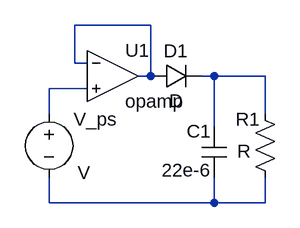
[diagram p0: schematic fig1.asc]
fig1.asc, the LTspice schematic file:
Version 4
SHEET 1 880 680
WIRE 224 64 128 64
WIRE 128 112 128 64
WIRE 144 112 128 112
WIRE 224 128 224 64
WIRE 224 128 208 128
WIRE 304 128 288 128
WIRE 368 128 304 128
WIRE 144 144 96 144
WIRE 96 176 96 144
WIRE 368 176 368 128
WIRE 304 192 304 128
WIRE 96 288 96 256
WIRE 304 288 304 256
WIRE 304 288 96 288
WIRE 368 288 368 256
WIRE 368 288 304 288
SYMBOL Opamps\\opamp 176 64 R0
SYMATTR InstName U1
SYMBOL voltage 96 160 R0
WINDOW 0 31 23 Left 2
WINDOW 3 36 90 Left 2
SYMATTR InstName V_ps
SYMBOL diode 224 144 R270
WINDOW 0 32 32 VTop 2
WINDOW 3 0 32 VBottom 2
SYMATTR InstName D1
SYMBOL cap 288 192 R0
WINDOW 0 -19 6 Left 2
WINDOW 3 -50 55 Left 2
SYMATTR InstName C1
SYMATTR Value 22e-6
SYMBOL res 352 160 R0
WINDOW 0 -21 23 Left 2
WINDOW 3 -19 63 Left 2
SYMATTR InstName R1

The netlist it stands for:
* fig1.asc
XU1 N001 N003 N001 opamp Aol=100K GBW=10Meg  ; pins invin noninvin out
V_ps N003 N004 V
D1 N001 N002 D
C1 N002 N004 22e-6
R1 N002 N004 R
.model D D
.lib standard.dio
.backanno
.end